# EAGLE schematic mother2 (EAGLE 8.3.1)
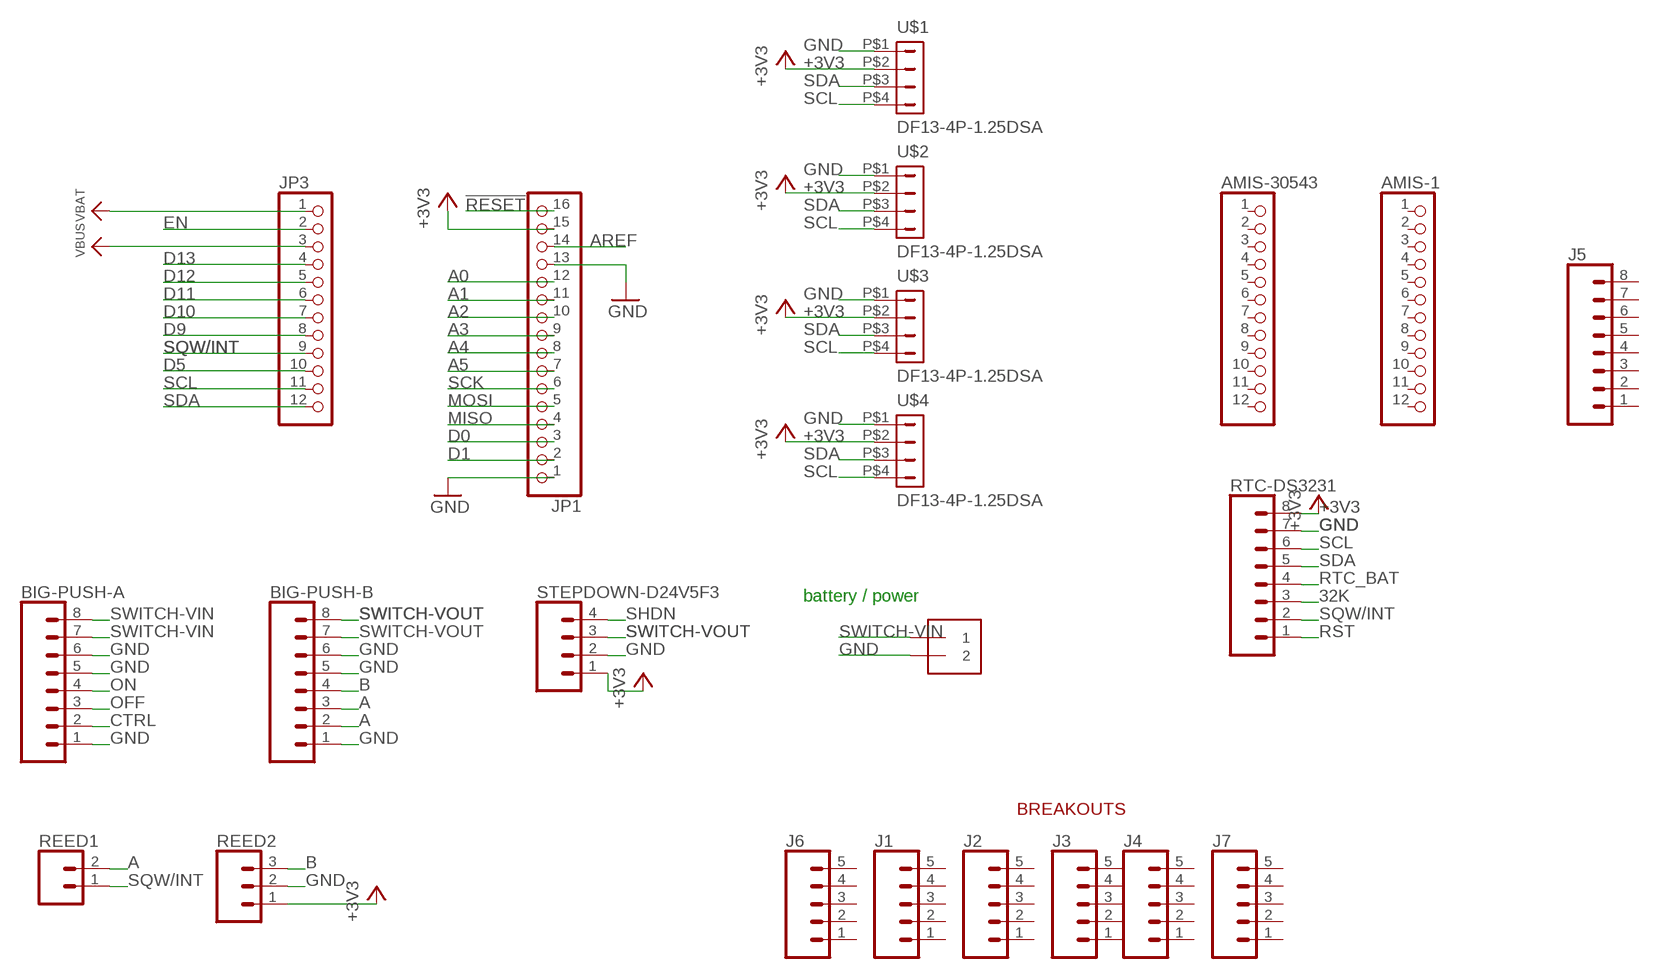
[diagram p0: schematic, sheet 1]

## Parts
AMIS-1  PINHD-1X12-CB  [1X12-CB]
AMIS-30543  PINHD-1X12-CB  [1X12-CB]
BAT  1X2-3.5MM  [1X2-3.5MM]
BIG-PUSH-A  CONN_08"  [1X08]
BIG-PUSH-B  CONN_08"  [1X08]
J1  CONN_05  [1X05]
J2  CONN_05  [1X05]
J3  CONN_05  [1X05]
J4  CONN_05  [1X05]
J5  CONN_08"  [1X08]
J6  CONN_05  [1X05]
J7  CONN_05  [1X05]
JP1  HEADER-1X16ROUND  [1X16_ROUND]
JP3  HEADER-1X12  [1X12_ROUND]
REED1  CONN_02  [1X02]
REED2  CONN_03  [1X03]
RTC-DS3231  CONN_08"  [1X08]
STEPDOWN-D24V5F3  CONN_04  [1X04]
U$1  DF13-4P-1.25DSA  [DF13-4P-1.25DSA]
U$2  DF13-4P-1.25DSA  [DF13-4P-1.25DSA]
U$3  DF13-4P-1.25DSA  [DF13-4P-1.25DSA]
U$4  DF13-4P-1.25DSA  [DF13-4P-1.25DSA]

## Nets
32K: RTC-DS3231.3
!RESET: JP1.16
+3V3: JP1.15 REED2.1 RTC-DS3231.8 STEPDOWN-D24V5F3.1 U$1.P$2 U$2.P$2 U$3.P$2 U$4.P$2
A: BIG-PUSH-B.2 BIG-PUSH-B.3 REED1.2
A0: JP1.12
A1: JP1.11
A2: JP1.10
A3: JP1.9
A4: JP1.8
A5: JP1.7
AREF: JP1.14
B: BIG-PUSH-B.4 REED2.3
CTRL: BIG-PUSH-A.2
D0: JP1.3
D1: JP1.2
D5: JP3.10
D9: JP3.8
D10: JP3.7
D11: JP3.6
D12: JP3.5
D13: JP3.4
EN: JP3.2
GND: BAT.2 BIG-PUSH-A.1 BIG-PUSH-A.5 BIG-PUSH-A.6 BIG-PUSH-B.1 BIG-PUSH-B.5 BIG-PUSH-B.6 JP1.1 JP1.13 REED2.2 RTC-DS3231.7 STEPDOWN-D24V5F3.2 U$1.P$1 U$2.P$1 U$3.P$1 U$4.P$1
MISO: JP1.4
MOSI: JP1.5
OFF: BIG-PUSH-A.3
ON: BIG-PUSH-A.4
RST: RTC-DS3231.1
RTC_BAT: RTC-DS3231.4
SCK: JP1.6
SCL: JP3.11 RTC-DS3231.6 U$1.P$4 U$2.P$4 U$3.P$4 U$4.P$4
SDA: JP3.12 RTC-DS3231.5 U$1.P$3 U$2.P$3 U$3.P$3 U$4.P$3
SHDN: STEPDOWN-D24V5F3.4
SQW/INT: JP3.9 REED1.1 RTC-DS3231.2
SWITCH-VIN: BAT.1 BIG-PUSH-A.7 BIG-PUSH-A.8
SWITCH-VOUT: BIG-PUSH-B.7 BIG-PUSH-B.8 STEPDOWN-D24V5F3.3
VBAT: JP3.1
VBUS: JP3.3
Unconnected: AMIS-1.1 AMIS-1.2 AMIS-1.3 AMIS-1.4 AMIS-1.5 AMIS-1.6 AMIS-1.7 AMIS-1.8 AMIS-1.9 AMIS-1.10 AMIS-1.11 AMIS-1.12 AMIS-30543.1 AMIS-30543.2 AMIS-30543.3 AMIS-30543.4 AMIS-30543.5 AMIS-30543.6 AMIS-30543.7 AMIS-30543.8 AMIS-30543.9 AMIS-30543.10 AMIS-30543.11 AMIS-30543.12 J1.1 J1.2 J1.3 J1.4 J1.5 J2.1 J2.2 J2.3 J2.4 J2.5 J3.1 J3.2 J3.3 J3.4 J3.5 J4.1 J4.2 J4.3 J4.4 J4.5 J5.1 J5.2 J5.3 J5.4 J5.5 J5.6 J5.7 J5.8 J6.1 J6.2 J6.3 J6.4 J6.5 J7.1 J7.2 J7.3 J7.4 J7.5

## Notes on the sheet
- battery / power
- BREAKOUTS

## Library data of the parts
AMIS-1 AMIS-30543 = adafruit:PINHD-1X12: PIN HEADER
BAT = adafruit:1X2: 3.5mm Terminal block http://www.ladyada.net/library/pcb/eaglelibrary.html
BIG-PUSH-A BIG-PUSH-B J5 RTC-DS3231 = SparkFun-Connectors:CONN_08: Multi connection point. Often used as Generic Header-pin footprint for 0.1 inch spaced/style header connections On any of the 0.1 inch spaced packages, you can populate with these: Break Away Headers - Straight <https://www.sparkfun.com/products/116> (PRT-00116) Break Away Male Headers - Right Angle <https://www.sparkfun.com/products/553> (PRT-00553) Female Headers <https://www.sparkfun.com/products/115> (PRT-00115) Break Away Headers - Machine Pin <https://www.sparkfun.com/products/117> (PRT-00117) Break Away Female Headers - Swiss Machine Pin <https://www.sparkfun.com/products/743> (PRT-00743) Arduino Stackable Header - 8 Pin <https://www.sparkfun.com/products/9279> (PRT-09279) For SCREWTERMINALS and SPRING TERMINALS visit here: Screw Terimnals on SparkFun.com <https://www.sparkfun.com/search/results?term=Screw+Terminals> (5mm/3.5mm/2.54mm spacing) This device is also useful as a general connection point to wire up your design to another part of your project. Our various solder wires solder well into these plated through hole pads. Hook-Up Wire - Assortment (Stranded, 22 AWG) <https://www.sparkfun.com/products/11375> (PRT-11375) Hook-Up Wire - Assortment (Solid Core, 22 AWG) <https://www.sparkfun.com/products/11367> (PRT-11367) View the entire wire category on our website here <https://www.sparkfun.com/categories/141> Special notes: Molex polarized connector foot print use with SKU : PRT-08231 with associated crimp pins and housings. 1MM SMD Version SKU: PRT-10208 NOTES ON THE VARIANTS LOCK and LOCK_LONGPADS... This footprint was designed to help hold the alignment of a through-hole component (i.e. 6-pin header) while soldering it into place. You may notice that each hole has been shifted either up or down by 0.005 of an inch from it's more standard position (which is a perfectly straight line). This slight alteration caused the pins (the squares in the middle) to touch the edges of the holes. Because they are alternating, it causes a "brace" to hold the component in place. 0.005 has proven to be the perfect amount of "off-center" position when using our standard breakaway headers. Although looks a little odd when you look at the bare footprint, once you have a header in there, the alteration is very hard to notice. Also,if you push a header all the way into place, it is covered up entirely on the bottom side.; PROD_ID: CONN-08438
J1-J4 J6 J7 = SparkFun-Connectors:CONN_05: Multi connection point. Often used as Generic Header-pin footprint for 0.1 inch spaced/style header connections On any of the 0.1 inch spaced packages, you can populate with these: Break Away Headers - Straight <https://www.sparkfun.com/products/116> (PRT-00116) Break Away Male Headers - Right Angle <https://www.sparkfun.com/products/553> (PRT-00553) Female Headers <https://www.sparkfun.com/products/115> (PRT-00115) Break Away Headers - Machine Pin <https://www.sparkfun.com/products/117> (PRT-00117) Break Away Female Headers - Swiss Machine Pin <https://www.sparkfun.com/products/743> (PRT-00743) For SCREWTERMINALS and SPRING TERMINALS visit here: Screw Terimnals on SparkFun.com <https://www.sparkfun.com/search/results?term=Screw+Terminals> (5mm/3.5mm/2.54mm spacing) This device is also useful as a general connection point to wire up your design to another part of your project. Our various solder wires solder well into these plated through hole pads. Hook-Up Wire - Assortment (Stranded, 22 AWG) <https://www.sparkfun.com/products/11375> (PRT-11375) Hook-Up Wire - Assortment (Solid Core, 22 AWG) <https://www.sparkfun.com/products/11367> (PRT-11367) View the entire wire category on our website here <https://www.sparkfun.com/categories/141> Special notes: Molex polarized connector foot print use with SKU : PRT-08231 with associated crimp pins and housings. 1MM SMD Version SKU: PRT-10208
JP1 = microbuilder:HEADER-1X16: PIN HEADER
JP3 = microbuilder:HEADER-1X12
REED1 = SparkFun-Connectors:CONN_02: Multi connection point. Often used as Generic Header-pin footprint for 0.1 inch spaced/style header connections On any of the 0.1 inch spaced packages, you can populate with these: Break Away Headers - Straight <https://www.sparkfun.com/products/116> (PRT-00116) Break Away Male Headers - Right Angle <https://www.sparkfun.com/products/553> (PRT-00553) Female Headers <https://www.sparkfun.com/products/115> (PRT-00115) Break Away Headers - Machine Pin <https://www.sparkfun.com/products/117> (PRT-00117) Break Away Female Headers - Swiss Machine Pin <https://www.sparkfun.com/products/743> (PRT-00743) For SCREWTERMINALS and SPRING TERMINALS visit here: Screw Terimnals on SparkFun.com <https://www.sparkfun.com/search/results?term=Screw+Terminals> (5mm/3.5mm/2.54mm spacing) This device is also useful as a general connection point to wire up your design to another part of your project. Our various solder wires solder well into these plated through hole pads. Hook-Up Wire - Assortment (Stranded, 22 AWG) <https://www.sparkfun.com/products/11375> (PRT-11375) Hook-Up Wire - Assortment (Solid Core, 22 AWG) <https://www.sparkfun.com/products/11367> (PRT-11367) View the entire wire category on our website here <https://www.sparkfun.com/categories/141> Special notes: Molex polarized connector foot print use with: PRT-08233 with associated crimp pins and housings. 2.54_SCREWTERM for use with PRT-10571. 3.5mm Screw Terminal footprints for PRT-08084 5mm Screw Terminal footprints for use with PRT-08432
REED2 = SparkFun-Connectors:CONN_03: Multi connection point. Often used as Generic Header-pin footprint for 0.1 inch spaced/style header connections On any of the 0.1 inch spaced packages, you can populate with these: Break Away Headers - Straight <https://www.sparkfun.com/products/116> (PRT-00116) Break Away Male Headers - Right Angle <https://www.sparkfun.com/products/553> (PRT-00553) Female Headers <https://www.sparkfun.com/products/115> (PRT-00115) Break Away Headers - Machine Pin <https://www.sparkfun.com/products/117> (PRT-00117) Break Away Female Headers - Swiss Machine Pin <https://www.sparkfun.com/products/743> (PRT-00743) Stackable Header - 3 Pin (Female, 0.1") <https://www.sparkfun.com/products/13875> (PRT-13875) For SCREWTERMINALS and SPRING TERMINALS visit here: Screw Terimnals on SparkFun.com <https://www.sparkfun.com/search/results?term=Screw+Terminals> (5mm/3.5mm/2.54mm spacing) This device is also useful as a general connection point to wire up your design to another part of your project. Our various solder wires solder well into these plated through hole pads. Hook-Up Wire - Assortment (Stranded, 22 AWG) <https://www.sparkfun.com/products/11375> (PRT-11375) Hook-Up Wire - Assortment (Solid Core, 22 AWG) <https://www.sparkfun.com/products/11367> (PRT-11367) View the entire wire category on our website here <https://www.sparkfun.com/categories/141> Special notes: Molex polarized connector foot print use with SKU : PRT-08232 with associated crimp pins and housings.
STEPDOWN-D24V5F3 = SparkFun-Connectors:CONN_04: Multi connection point. Often used as Generic Header-pin footprint for 0.1 inch spaced/style header connections On any of the 0.1 inch spaced packages, you can populate with these: Break Away Headers - Straight <https://www.sparkfun.com/products/116> (PRT-00116) Break Away Male Headers - Right Angle <https://www.sparkfun.com/products/553> (PRT-00553) Female Headers <https://www.sparkfun.com/products/115> (PRT-00115) Break Away Headers - Machine Pin <https://www.sparkfun.com/products/117> (PRT-00117) Break Away Female Headers - Swiss Machine Pin <https://www.sparkfun.com/products/743> (PRT-00743) For SCREWTERMINALS and SPRING TERMINALS visit here: Screw Terimnals on SparkFun.com <https://www.sparkfun.com/search/results?term=Screw+Terminals> (5mm/3.5mm/2.54mm spacing) This device is also useful as a general connection point to wire up your design to another part of your project. Our various solder wires solder well into these plated through hole pads. Hook-Up Wire - Assortment (Stranded, 22 AWG) <https://www.sparkfun.com/products/11375> (PRT-11375) Hook-Up Wire - Assortment (Solid Core, 22 AWG) <https://www.sparkfun.com/products/11367> (PRT-11367) View the entire wire category on our website here <https://www.sparkfun.com/categories/141> Special notes: Molex polarized connector foot print use with SKU : PRT-08231 with associated crimp pins and housings. 1MM SMD Version SKU: PRT-10208; PROD_ID: CONN-09696
U$1-U$4 = con-hirose-df13:DF13-4P-1.25: DF13-4P 1.25mm Pitch Miniature Crimping Connector.